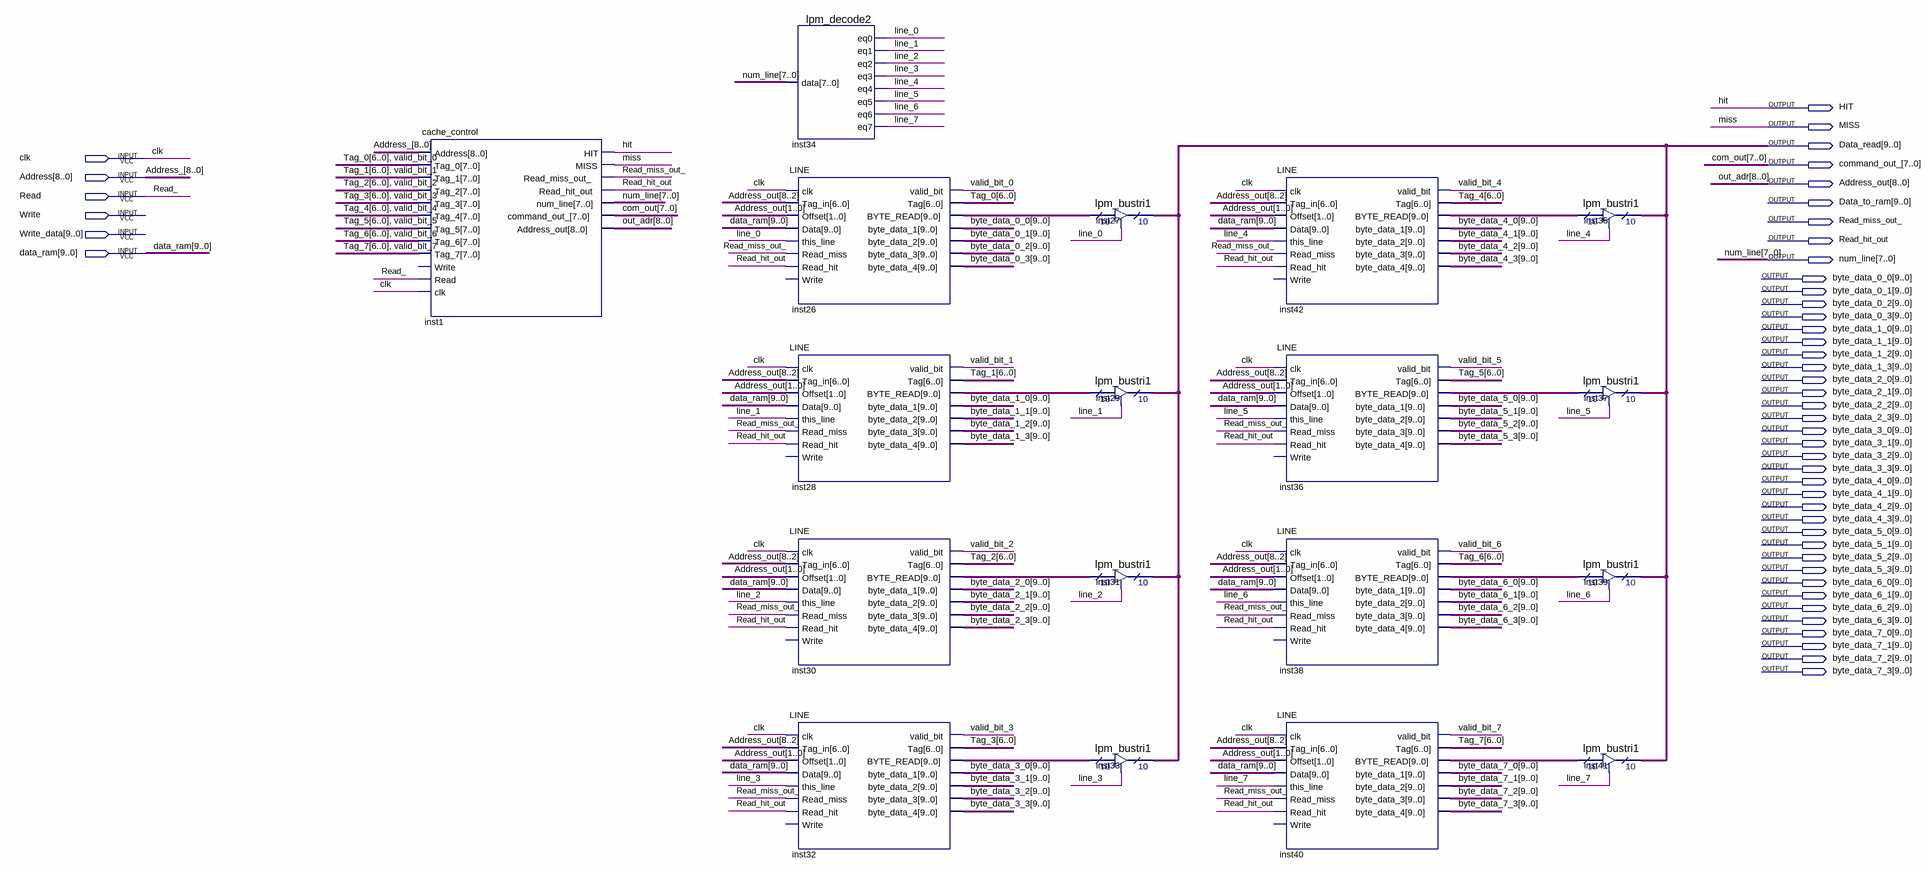
[diagram p0: schematic sheet]
// Quartus schematic CACHE.bdf as structural Verilog: 18 symbols, 47 pins
module CACHE (
  input  clk,
  input  [8:0] Address,
  input  Read,
  input  Write,
  input  [9:0] Write_data,
  input  [9:0] data_ram,
  output HIT,
  output MISS,
  output [9:0] Data_read,
  output [7:0] command_out_,
  output [8:0] Address_out,
  output [9:0] Data_to_ram,
  output Read_miss_out_,
  output Read_hit_out,
  output [7:0] num_line,
  output [9:0] byte_data_0_0,
  output [9:0] byte_data_0_1,
  output [9:0] byte_data_0_2,
  output [9:0] byte_data_0_3,
  output [9:0] byte_data_1_0,
  output [9:0] byte_data_1_1,
  output [9:0] byte_data_1_2,
  output [9:0] byte_data_1_3,
  output [9:0] byte_data_2_0,
  output [9:0] byte_data_2_1,
  output [9:0] byte_data_2_2,
  output [9:0] byte_data_2_3,
  output [9:0] byte_data_3_0,
  output [9:0] byte_data_3_1,
  output [9:0] byte_data_3_2,
  output [9:0] byte_data_3_3,
  output [9:0] byte_data_4_0,
  output [9:0] byte_data_4_1,
  output [9:0] byte_data_4_2,
  output [9:0] byte_data_4_3,
  output [9:0] byte_data_5_0,
  output [9:0] byte_data_5_1,
  output [9:0] byte_data_5_2,
  output [9:0] byte_data_5_3,
  output [9:0] byte_data_6_0,
  output [9:0] byte_data_6_1,
  output [9:0] byte_data_6_2,
  output [9:0] byte_data_6_3,
  output [9:0] byte_data_7_0,
  output [9:0] byte_data_7_1,
  output [9:0] byte_data_7_2,
  output [9:0] byte_data_7_3
);

  wire line_0, line_1, line_2, line_3, line_4, line_5, line_6, line_7, valid_bit_0, valid_bit_1, valid_bit_2,
       valid_bit_3, valid_bit_4, valid_bit_5, valid_bit_6, valid_bit_7;
  wire [6:0] Tag_0, Tag_1, Tag_2, Tag_3, Tag_4, Tag_5, Tag_6, Tag_7;
  wire [9:0] inst26_byte_read, inst28_byte_read, inst30_byte_read, inst32_byte_read, inst36_byte_read,
       inst38_byte_read, inst40_byte_read, inst42_byte_read;

  cache_control inst1 (
    .Address(Address), .Tag_0({Tag_0, valid_bit_0}), .Tag_1({Tag_1, valid_bit_1}),
    .Tag_2({Tag_2, valid_bit_2}), .Tag_3({Tag_3, valid_bit_3}), .Tag_4({Tag_4, valid_bit_4}),
    .Tag_5({Tag_5, valid_bit_5}), .Tag_6({Tag_6, valid_bit_6}), .Tag_7({Tag_7, valid_bit_7}), .Read(Read),
    .clk(clk), .HIT(HIT), .MISS(MISS), .Read_miss_out_(Read_miss_out_), .Read_hit_out(Read_hit_out),
    .num_line(num_line), .command_out_(command_out_), .Address_out(Address_out));  // open: Write
  lpm_decode2 inst34 (
    .data(num_line), .eq0(line_0), .eq1(line_1), .eq2(line_2), .eq3(line_3), .eq4(line_4), .eq5(line_5),
    .eq6(line_6), .eq7(line_7));
  LINE inst26 (
    .clk(clk), .Tag_in(Address_out[8:2]), .Offset(Address_out[1:0]), .Data(data_ram), .this_line(line_0),
    .Read_miss(Read_miss_out_), .Read_hit(Read_hit_out), .valid_bit(valid_bit_0), .Tag(Tag_0),
    .BYTE_READ(inst26_byte_read), .byte_data_1(byte_data_0_0), .byte_data_2(byte_data_0_1),
    .byte_data_3(byte_data_0_2), .byte_data_4(byte_data_0_3));  // open: Write
  LINE inst28 (
    .clk(clk), .Tag_in(Address_out[8:2]), .Offset(Address_out[1:0]), .Data(data_ram), .this_line(line_1),
    .Read_miss(Read_miss_out_), .Read_hit(Read_hit_out), .valid_bit(valid_bit_1), .Tag(Tag_1),
    .BYTE_READ(inst28_byte_read), .byte_data_1(byte_data_1_0), .byte_data_2(byte_data_1_1),
    .byte_data_3(byte_data_1_2), .byte_data_4(byte_data_1_3));  // open: Write
  LINE inst30 (
    .clk(clk), .Tag_in(Address_out[8:2]), .Offset(Address_out[1:0]), .Data(data_ram), .this_line(line_2),
    .Read_miss(Read_miss_out_), .Read_hit(Read_hit_out), .valid_bit(valid_bit_2), .Tag(Tag_2),
    .BYTE_READ(inst30_byte_read), .byte_data_1(byte_data_2_0), .byte_data_2(byte_data_2_1),
    .byte_data_3(byte_data_2_2), .byte_data_4(byte_data_2_3));  // open: Write
  LINE inst32 (
    .clk(clk), .Tag_in(Address_out[8:2]), .Offset(Address_out[1:0]), .Data(data_ram), .this_line(line_3),
    .Read_miss(Read_miss_out_), .Read_hit(Read_hit_out), .valid_bit(valid_bit_3), .Tag(Tag_3),
    .BYTE_READ(inst32_byte_read), .byte_data_1(byte_data_3_0), .byte_data_2(byte_data_3_1),
    .byte_data_3(byte_data_3_2), .byte_data_4(byte_data_3_3));  // open: Write
  lpm_bustri1 inst27 (.enabledt(line_0), .data(inst26_byte_read), .tridata(Data_read));
  lpm_bustri1 inst29 (.enabledt(line_1), .data(inst28_byte_read), .tridata(Data_read));
  lpm_bustri1 inst31 (.enabledt(line_2), .data(inst30_byte_read), .tridata(Data_read));
  lpm_bustri1 inst33 (.enabledt(line_3), .data(inst32_byte_read), .tridata(Data_read));
  LINE inst42 (
    .clk(clk), .Tag_in(Address_out[8:2]), .Offset(Address_out[1:0]), .Data(data_ram), .this_line(line_4),
    .Read_miss(Read_miss_out_), .Read_hit(Read_hit_out), .valid_bit(valid_bit_4), .Tag(Tag_4),
    .BYTE_READ(inst42_byte_read), .byte_data_1(byte_data_4_0), .byte_data_2(byte_data_4_1),
    .byte_data_3(byte_data_4_2), .byte_data_4(byte_data_4_3));  // open: Write
  LINE inst36 (
    .clk(clk), .Tag_in(Address_out[8:2]), .Offset(Address_out[1:0]), .Data(data_ram), .this_line(line_5),
    .Read_miss(Read_miss_out_), .Read_hit(Read_hit_out), .valid_bit(valid_bit_5), .Tag(Tag_5),
    .BYTE_READ(inst36_byte_read), .byte_data_1(byte_data_5_0), .byte_data_2(byte_data_5_1),
    .byte_data_3(byte_data_5_2), .byte_data_4(byte_data_5_3));  // open: Write
  LINE inst38 (
    .clk(clk), .Tag_in(Address_out[8:2]), .Offset(Address_out[1:0]), .Data(data_ram), .this_line(line_6),
    .Read_miss(Read_miss_out_), .Read_hit(Read_hit_out), .valid_bit(valid_bit_6), .Tag(Tag_6),
    .BYTE_READ(inst38_byte_read), .byte_data_1(byte_data_6_0), .byte_data_2(byte_data_6_1),
    .byte_data_3(byte_data_6_2), .byte_data_4(byte_data_6_3));  // open: Write
  LINE inst40 (
    .clk(clk), .Tag_in(Address_out[8:2]), .Offset(Address_out[1:0]), .Data(data_ram), .this_line(line_7),
    .Read_miss(Read_miss_out_), .Read_hit(Read_hit_out), .valid_bit(valid_bit_7), .Tag(Tag_7),
    .BYTE_READ(inst40_byte_read), .byte_data_1(byte_data_7_0), .byte_data_2(byte_data_7_1),
    .byte_data_3(byte_data_7_2), .byte_data_4(byte_data_7_3));  // open: Write
  lpm_bustri1 inst35 (.enabledt(line_4), .data(inst42_byte_read), .tridata(Data_read));
  lpm_bustri1 inst37 (.enabledt(line_5), .data(inst36_byte_read), .tridata(Data_read));
  lpm_bustri1 inst39 (.enabledt(line_6), .data(inst38_byte_read), .tridata(Data_read));
  lpm_bustri1 inst41 (.enabledt(line_7), .data(inst40_byte_read), .tridata(Data_read));

  // Other names for the same wires on the sheet: Address_[8:0] = Address; com_out[7:0] = command_out_;
  //   out_adr[8:0] = Address_out; Read_ = Read
endmodule
